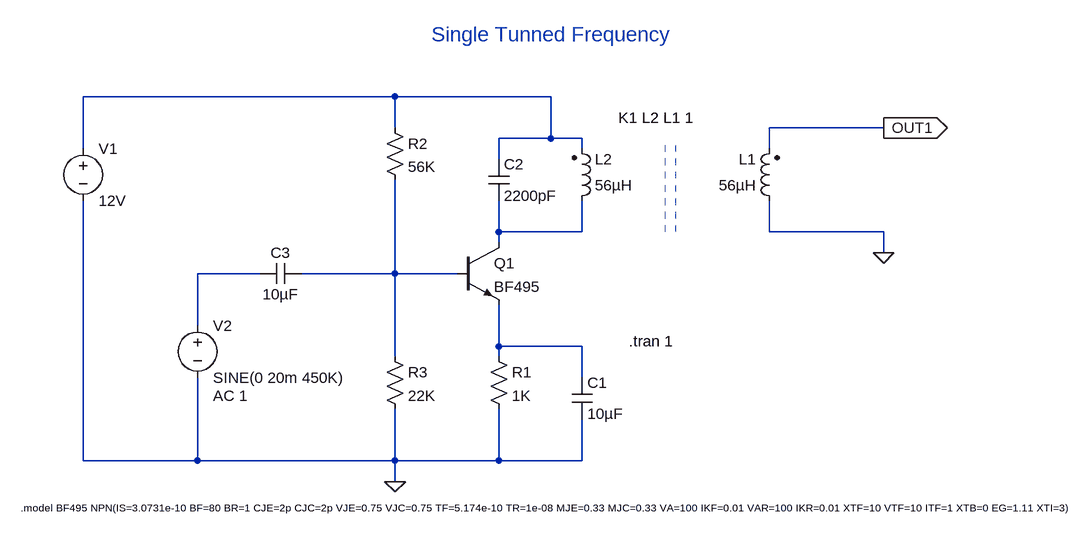
[diagram p0: schematic Single_Tuned_Ampl.asc]
Single_Tuned_Ampl.asc, the LTspice schematic file:
Version 4
SHEET 1 2396 680
WIRE 96 -80 -384 -80
WIRE 336 -80 96 -80
WIRE 96 -32 96 -80
WIRE 848 -32 672 -32
WIRE 336 -16 336 -80
WIRE 336 -16 256 -16
WIRE 384 -16 336 -16
WIRE -384 0 -384 -80
WIRE 384 0 384 -16
WIRE 672 0 672 -32
WIRE 256 16 256 -16
WIRE 256 128 256 80
WIRE 384 128 384 80
WIRE 384 128 256 128
WIRE 672 128 672 80
WIRE 848 128 672 128
WIRE 256 144 256 128
WIRE 848 160 848 128
WIRE -112 192 -208 192
WIRE 96 192 96 48
WIRE 96 192 -48 192
WIRE 192 192 96 192
WIRE -208 272 -208 192
WIRE 256 304 256 240
WIRE 384 304 256 304
WIRE 96 320 96 192
WIRE 256 320 256 304
WIRE 384 352 384 304
WIRE -384 480 -384 80
WIRE -208 480 -208 352
WIRE -208 480 -384 480
WIRE 96 480 96 400
WIRE 96 480 -208 480
WIRE 256 480 256 400
WIRE 256 480 96 480
WIRE 384 480 384 416
WIRE 384 480 256 480
WIRE 96 512 96 480
FLAG 848 160 0
FLAG 96 512 0
FLAG 848 -32 OUT1
IOPIN 848 -32 Out
SYMBOL npn 192 144 R0
SYMATTR InstName Q1
SYMATTR Value BF495
SYMBOL res 240 304 R0
SYMATTR InstName R1
SYMATTR Value 1K
SYMBOL res 80 -48 R0
SYMATTR InstName R2
SYMATTR Value 56K
SYMBOL res 80 304 R0
SYMATTR InstName R3
SYMATTR Value 22K
SYMBOL cap 368 352 R0
SYMATTR InstName C1
SYMATTR Value 10µF
SYMBOL cap 240 16 R0
SYMATTR InstName C2
SYMATTR Value 2200pF
SYMBOL ind2 688 96 R180
WINDOW 0 36 80 Left 2
WINDOW 3 36 40 Left 2
SYMATTR InstName L1
SYMATTR Value 56µH
SYMBOL ind2 368 96 M180
WINDOW 0 36 80 Left 2
WINDOW 3 36 40 Left 2
SYMATTR InstName L2
SYMATTR Value 56µH
SYMBOL voltage -384 -16 R0
WINDOW 123 0 0 Left 0
WINDOW 39 0 0 Left 0
SYMATTR InstName V1
SYMATTR Value 12V
SYMBOL voltage -208 256 R0
WINDOW 123 24 124 Left 2
WINDOW 39 0 0 Left 0
SYMATTR Value2 AC 1
SYMATTR InstName V2
SYMATTR Value SINE(0 20m 450K)
SYMBOL cap -48 176 R90
WINDOW 0 0 32 VBottom 2
WINDOW 3 32 32 VTop 2
SYMATTR InstName C3
SYMATTR Value 10µF
TEXT 440 -48 Left 2 !K1 L2 L1 1
TEXT -480 552 Left 1 !.model BF495 NPN(IS=3.0731e-10 BF=80 BR=1 CJE=2p CJC=2p VJE=0.75 VJC=0.75 TF=5.174e-10 TR=1e-08 MJE=0.33 MJC=0.33 VA=100 IKF=0.01 VAR=100 IKR=0.01 XTF=10 VTF=10 ITF=1 XTB=0 EG=1.11 XTI=3)
TEXT 456 296 Left 2 !.tran 1
TEXT 152 -176 Left 3 ;Single Tunned Frequency
LINE Normal 512 128 512 -16 2
LINE Normal 528 128 528 -16 2

The netlist it stands for:
* Single_Tuned_Ampl.asc
Q1 N002 N004 N005 0 BF495
R1 N005 0 1K
R2 N001 N004 56K
R3 N004 0 22K
C1 N005 0 10µF
C2 N001 N002 2200pF
L1 0 OUT1 56µH
L2 N002 N001 56µH
V1 N001 0 12V
V2 N003 0 SINE(0 20m 450K) AC 1
C3 N004 N003 10µF
.model NPN NPN
.model PNP PNP
.lib standard.bjt
K1 L2 L1 1
.model BF495 NPN(IS=3.0731e-10 BF=80 BR=1 CJE=2p CJC=2p VJE=0.75 VJC=0.75 TF=5.174e-10 TR=1e-08 MJE=0.33 MJC=0.33 VA=100 IKF=0.01 VAR=100 IKR=0.01 XTF=10 VTF=10 ITF=1 XTB=0 EG=1.11 XTI=3)
.tran 1
* Single Tunned Frequency
.backanno
.end